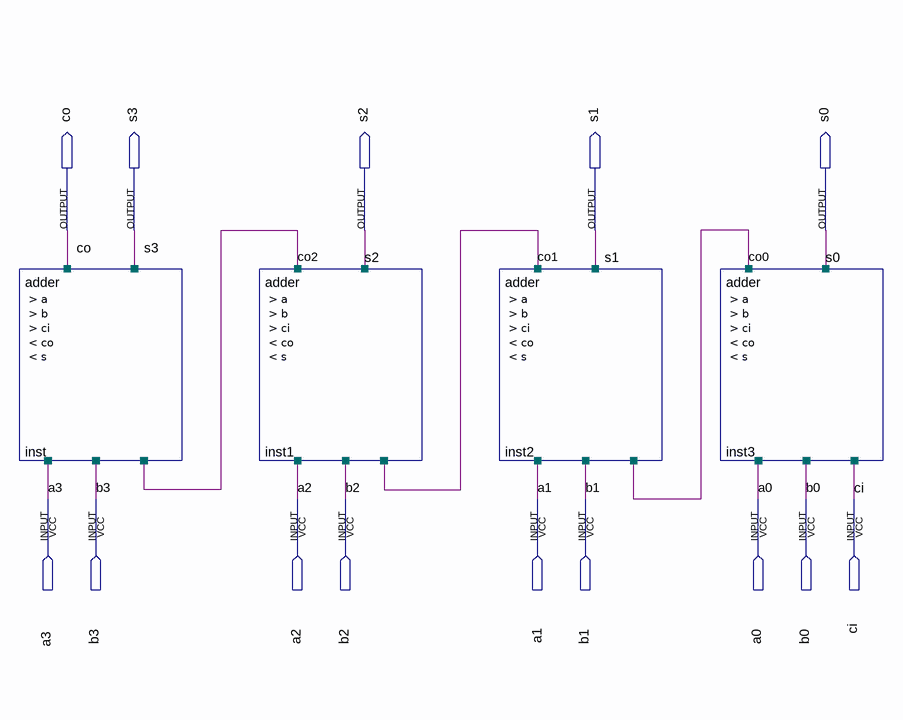
[diagram p0: schematic sheet]
// Quartus schematic 4fulladder.bdf as structural Verilog: 4 symbols, 14 pins
module \4fulladder  (
  input  a3,
  input  b3,
  input  a2,
  input  b2,
  input  a1,
  input  b1,
  input  a0,
  input  b0,
  input  ci,
  output co,
  output s3,
  output s2,
  output s1,
  output s0
);

  wire co0, co1, co2;

  adder inst (.a(a3), .b(b3), .ci(co2), .co(co), .s(s3));
  adder inst1 (.a(a2), .b(b2), .ci(co1), .co(co2), .s(s2));
  adder inst2 (.a(a1), .b(b1), .ci(co0), .co(co1), .s(s1));
  adder inst3 (.a(a0), .b(b0), .ci(ci), .co(co0), .s(s0));
endmodule
